# EAGLE design CTI_Osc (EAGLE 6.2)
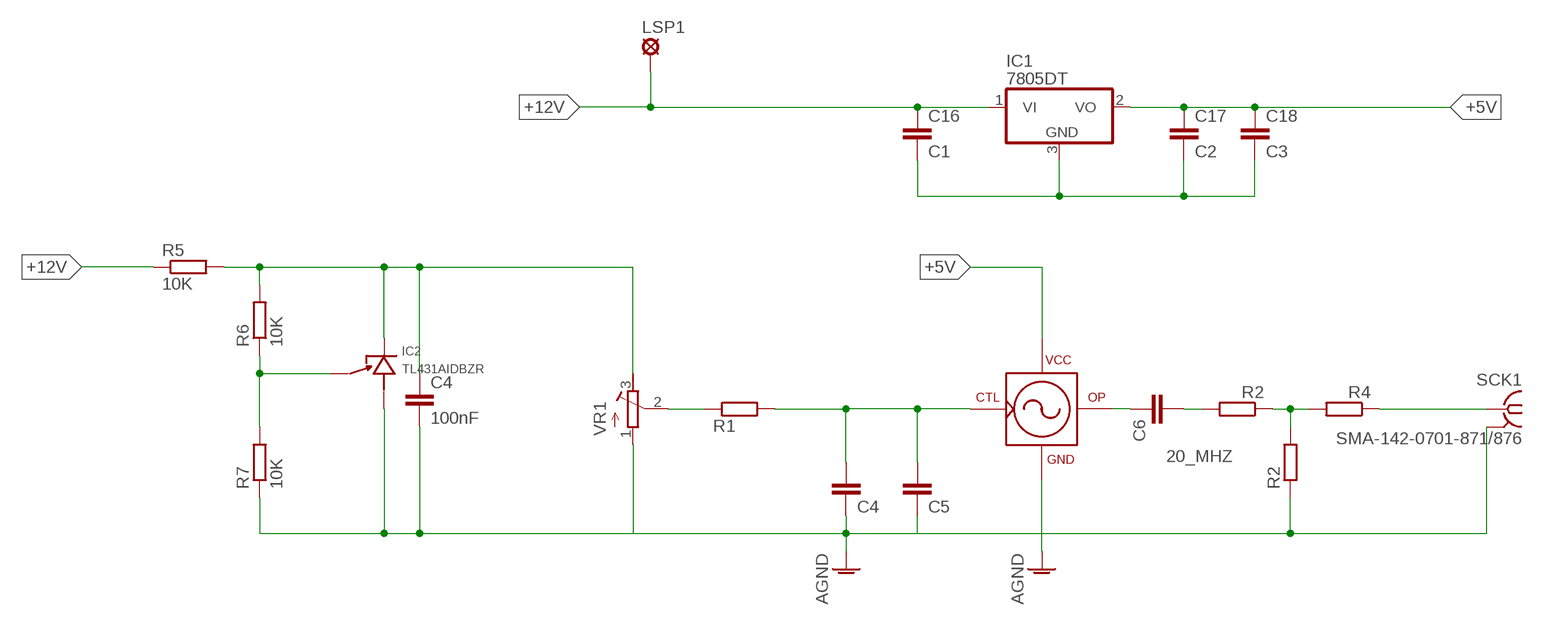
[diagram p0: schematic, sheet 1, part 1 of 2]
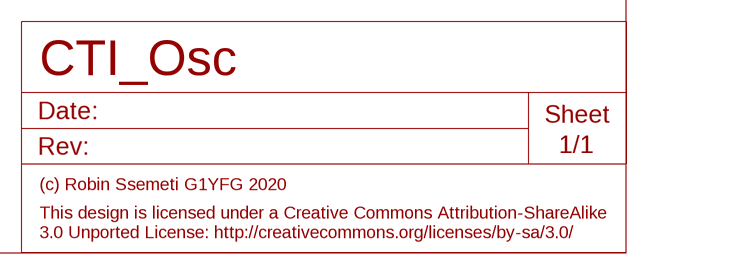
[diagram p1: schematic, sheet 1, part 2 of 2]

## Parts
C4  100nF  C-EUC0603  [C0603]
C16  C1  C-EUC0805  [C0805]
C17  C2  C-EUC0805  [C0805]
C18  C3  C-EUC0805  [C0805]
C24  C4  C-EUC0603  [C0603]
C25  C5  C-EUC0603  [C0603]
C28  C6  C-EUC0603  [C0603]
IC1  7805DT  [TO252]
IC2  TL431AIDBZR  [SOT23L]
LSP1  LSP13  [LSP13]
OSC1  CTI_OSC  [CTI_OSC]
R1  R2  R-EU_R0603  [R0603]
R2  R3  R-EU_R0603  [R0603]
R3  R4  R-EU_R0603  [R0603]
R5  10K  R-EU_R0603  [R0603]
R6  10K  R-EU_R0603  [R0603]
R7  10K  R-EU_R0603  [R0603]
R13  R1  R-EU_R0603  [R0603]
SCK1  SMA-142-0701-871/876  [J502-ND-142-0701-871/876]
VR2  VR1  R-TRIMM64Y  [RTRIM64Y]

## Nets
20_MHZ: C28.2 OSC1.OUT(OP)
+5V: C17.1 C18.1 IC1.2(VO) OSC1.VCC
+5V_PRECISION: C4.1 IC2.G(CATHODE) R5.2 R6.2 VR2.3(A)
+12V [PWR]: C16.1 IC1.1(VI) LSP1.MP R5.1
GND [PWR]: C4.2 C16.2 C17.2 C18.2 C24.2 C25.2 IC1.3(GND) IC2.D(ANODE) OSC1.GND R2.1 R7.1 SCK1.G@1(GND) VR2.1(E) ; supply symbol labelled AGND
N$1: C28.1 R1.2
N$2: R1.1 R2.2 R3.2
N$3: R3.1 SCK1.1
N$19: R13.1 VR2.2(S)
N$32: C24.1 C25.1 OSC1.REF(CTRL) R13.2
N$42: IC2.S(CTRL) R6.1 R7.2

## Power pins joined to a net without a drawn wire
GND: SCK1.G@2(GND) SCK1.G@3(GND) SCK1.G@4(GND)

## Library data of the parts
C4 C16-C18 C24 C25 = rcl:C-EU: CAPACITOR, European symbol
C28 = resistor:C-EU: CAPACITOR, European symbol
IC1 = linear:78*: Positive VOLTAGE REGULATOR Source: http://cache.national.com/ds/LM/LM78L05.pdf http://www.fairchildsemi.com/ds/LM/LM7805.pdf
IC2 = RF:TL431AIDBZR
LSP1 = solpad:LSP13: SOLDER PAD drill 1.3 mm, distributor Buerklin, 12H562
OSC1 = RF:CTI_OSC
R1-R3 R5-R7 R13 = rcl:R-EU_: RESISTOR, European symbol
SCK1 = con-coax:SMA-: SMA 50 Ohm End Launch Jack Receptacle - Round Contact Johnson Components Source: www.johnsoncomponents.com .. J502-ND.pdf; MF: JOHNSON COMPONENTS; MPN: 142-0701-871; OC_FARNELL: 1339835; OC_NEWARK: 91B6105
VR2 = resistor:R-TRIMM: Trimm resistor

## Net classes
1 50ohm: width 0.508 mm, clearance 0.762 mm
2 PWR: clearance 0.8 mm
3 TG: clearance 0.5 mm

## Board
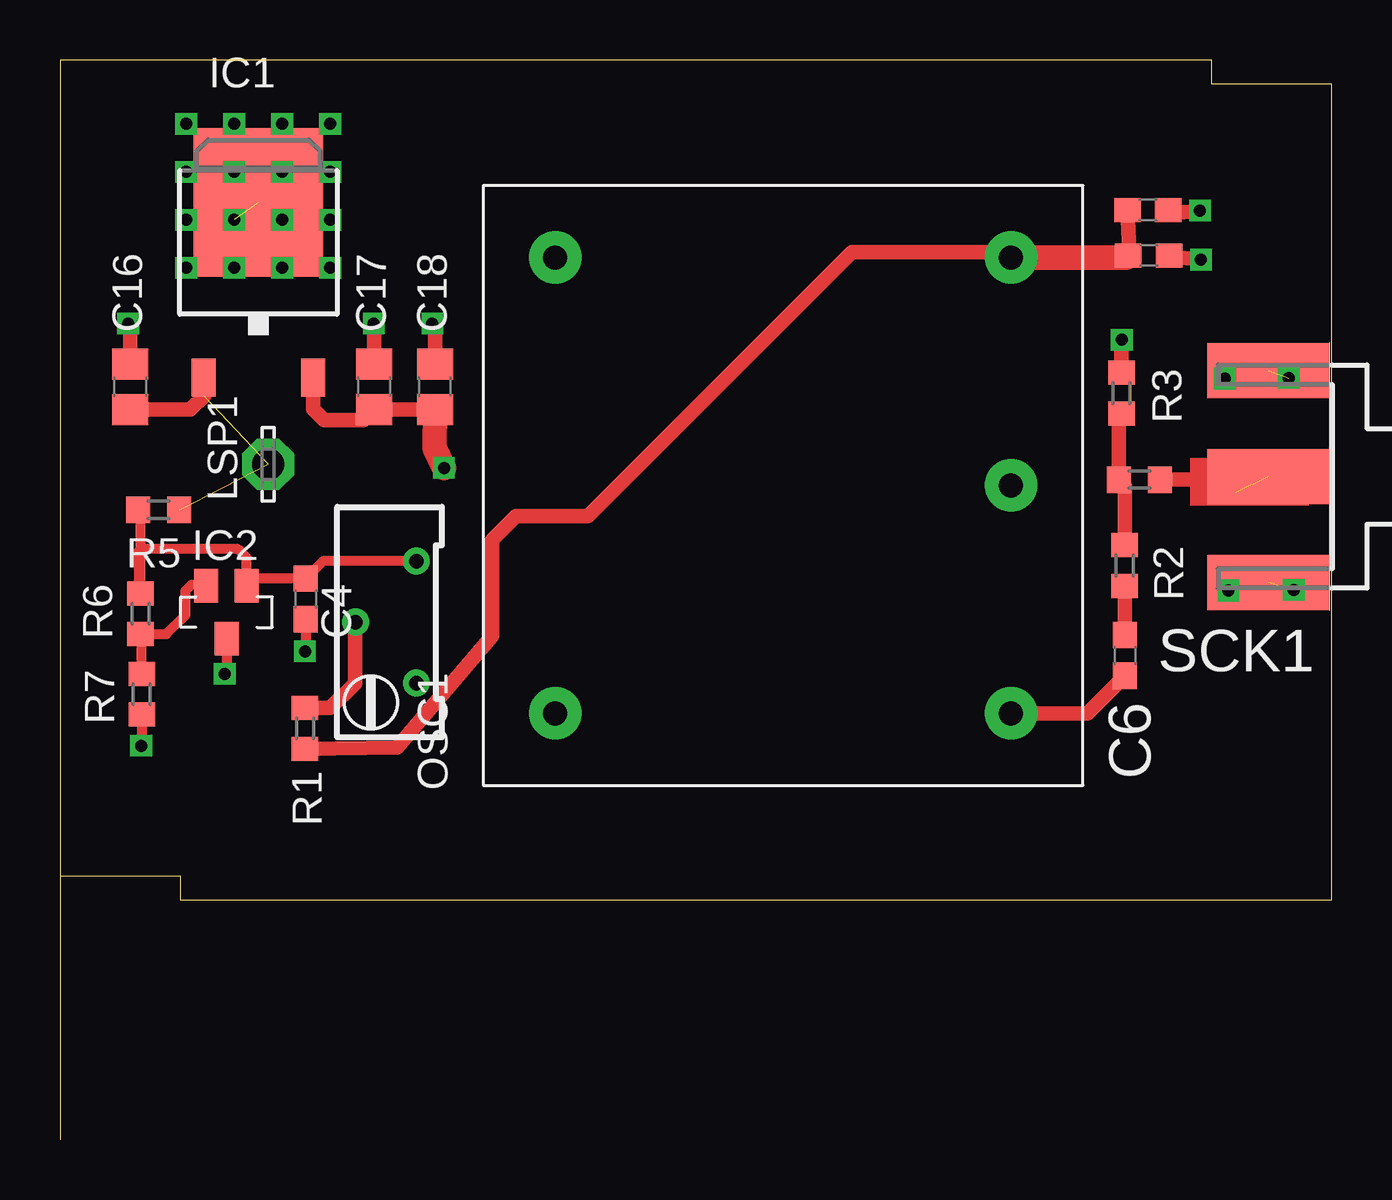
[diagram p2: board, top side]
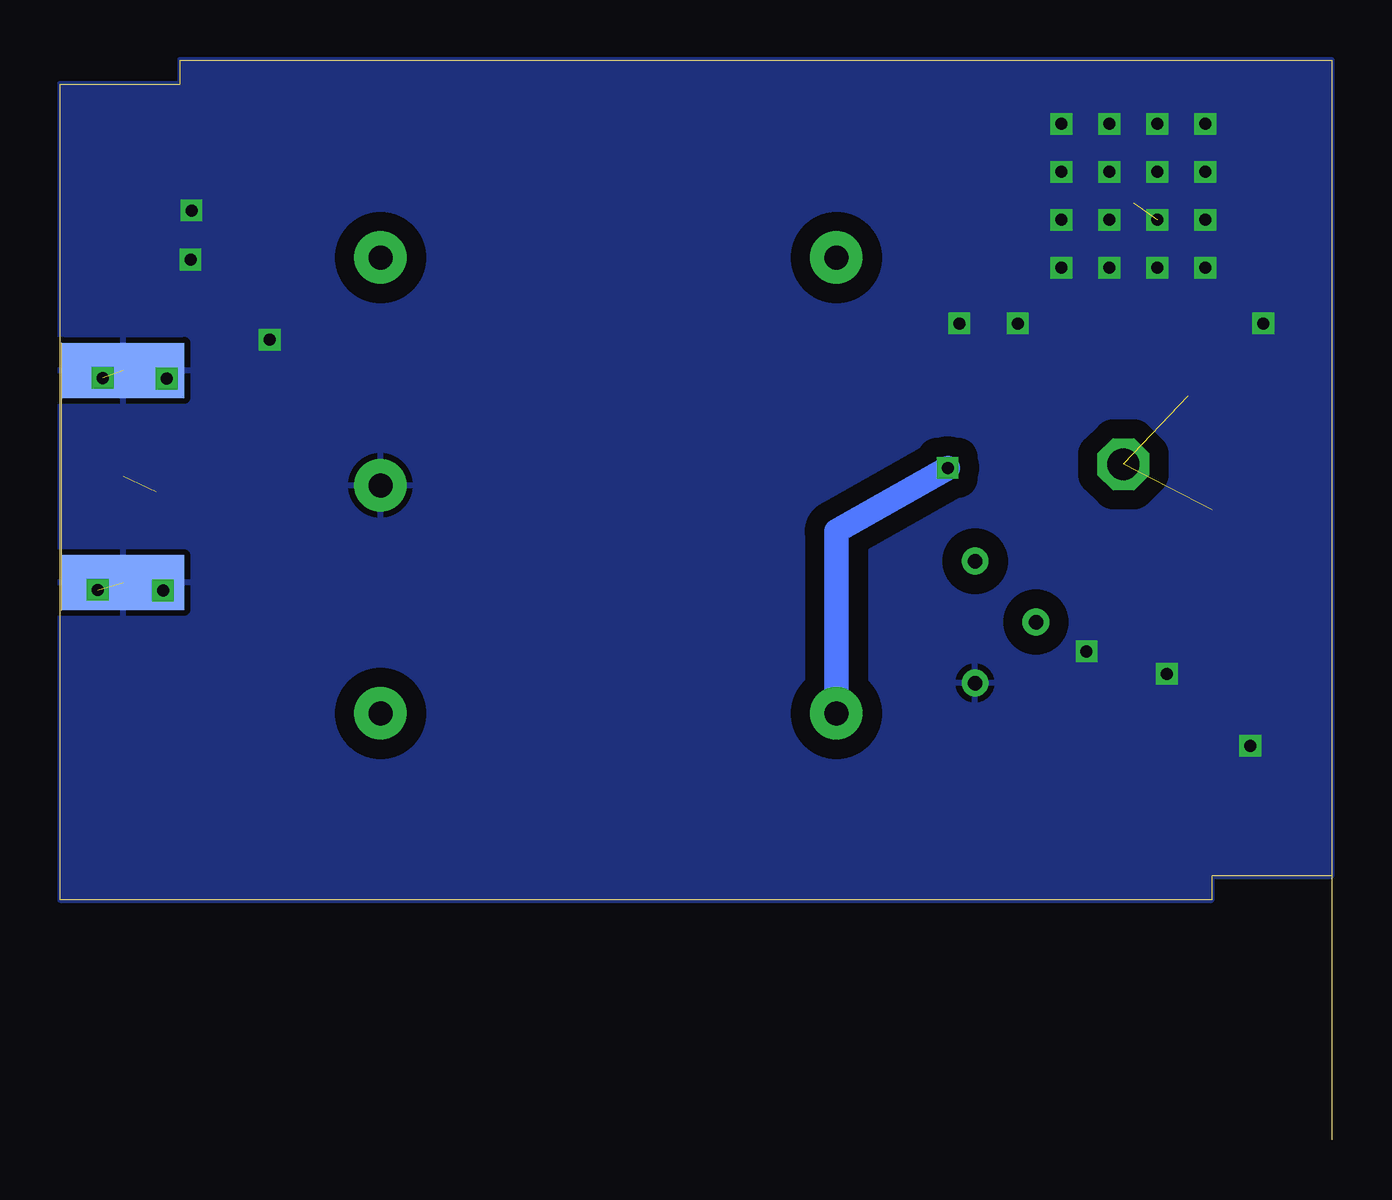
[diagram p3: board, bottom side, seen from below]

Size 53 x 45 mm. Coordinates in mm from the lower left corner, seen from the top.
Outline: 0,11 5,11 5,10 53,10 53,44 48,44 48,45 0,45 0,11
Outline: 0,11 0,0
Copper layers ((1*2)+(15*16)): Top 0.035mm / dielectric 1.5mm / Route2 0.035mm / dielectric 0.15mm / Route15 0.035mm / dielectric 0.2mm / Power 0.035mm
Design rules: minimum track width 10mil, minimum drill 0.3mm, track to track 5mil, track to pad 5mil, pad to pad 3mil, via to via 5mil, smd to smd 2mil, copper to edge 0mil, drill to drill 8mil, minimum pad ring 10mil, minimum via ring 8mil, stop-mask expansion 4mil, vias tented up to drill 0mil, thermal gap 10mil

### Footprints (pad centres in the part's own frame; a part is rotated, then mirrored left to right if it is on the bottom)
C0603 = smd 1.1 x 1: 1 -0.85,0; 2 0.85,0
C0805 = smd 1.3 x 1.5: 1 -0.95,0; 2 0.95,0
TO252 = smd 1 x 1.6: 1 -2.28,-4.8; 2 2.28,-4.8 | smd 5.4 x 6.2: 3 0,2.5
SOT23L = smd 1 x 1.4: D 0,1.1; G -0.85,-1.1; S 0.85,-1.1
LSP13 = drill 1.321 pad 2.159 octagon: MP 0,0
CTI_OSC = drill 1 pad 2.184: GND 0,-9.5; NC 9.5,9.5; OUT -9.5,-9.5; REF 9.5,-9.5; VCC -9.5,9.5
R0603 = smd 1 x 1.1: 1 -0.85,0; 2 0.85,0
J502-ND-142-0701-871/876 = smd 5.08 x 2.286: 1 2.565,0; G@1 2.565,4.42; G@2 2.565,-4.42 | smd 5.08 x 2.286 bottom: G@3 2.565,4.42; G@4 2.565,-4.42
RTRIM64Y = drill 0.61: 1 0,-2.54; 2 -2.54,0; 3 0,2.54

### Placement (x,y rotation side)
C4  10.25,22.54 270 top
C16  2.93,31.38 90 top
C17  13.09,31.38 90 top
C18  15.63,31.38 90 top
C24  45.38,36.85 0 top
C25  45.34,38.74 0 top
C28  44.39,20.18 270 top
IC1  8.27,36.56 0 top
IC2  6.94,21.98 180 top
LSP1  8.67,28.15 90 top
OSC1  30.14,27.27 90 top
R1  44.38,23.93 270 top
R2  44.24,31.11 270 top
R3  44.99,27.5 180 top
R5  4.12,26.25 180 top
R6  3.36,21.91 90 top
R7  3.41,18.56 90 top
R13  10.21,17.14 270 top
SCK1  52.92,27.64 180 top
VR2  14.86,21.57 0 top

### Tracks (layer width: path | path; a pad name or v marks a point on that pad's centre or on a via)
20_MHZ
  Top 0.61: OSC1.OUT 42.82,17.77 C28.2
+5V  (via drill 0.5)
  Top 0.61: C18.1 C17.1 12.66,30 11,30 10.55,30.45 IC1.2
  Top 1.016: v16,28 15.62,28.83 C18.1
  Power 1.016: v16,28 20.64,25.36 OSC1.VCC
+5V_PRECISION
  Top 0.406: VR2.3 10.97,24.11 C4.1 8.09,23.39 IC2.G 7.79,24.23 7.42,24.61 3.35,24.61 3.28,24.53 3.28,22.84 R6.2 3.36,26.16 R5.2
+12V  (2 unrouted)
  Top 0.61: C16.1 5.42,30.43 6,31 IC1.1
GND  (via drill 0.5)  (5 unrouted)
  Top 0.406: R7.1 3.41,16.45 v3.38,16.42 | IC2.D 6.94,19.49 v6.86,19.41 | C4.2 10.25,20.39 v10.21,20.35
  Top 0.61: R2.1 44.24,33.32 v44.26,33.34 | C24.2 46.5,36.79 v47.56,36.67 | C25.2 46.84,38.65 v47.52,38.73 | C16.2 2.93,33.94 v2.85,34.02 | C17.2 v13.09,34.01 v13.08,34.02 | C18.2 15.63,33.91 v15.52,34.02
  other vias: 48.55,31.72 51.22,31.75 48.7,22.89 51.42,22.91 5.26,42.34 7.26,42.34 9.26,42.34 11.26,42.34 5.26,40.34 7.26,40.34 9.26,40.34 11.26,40.34 11.26,38.34 9.26,38.34 7.26,38.34 5.26,38.34 5.26,36.34 7.26,36.34 9.26,36.34 11.26,36.34
  pour Power: 0,45 48,45 48,44 53,44 53,10 5,10 5,11 0,11
N$1
  Top 0.61: C28.1 44.39,23.06 R1.2
N$2
  Top 0.61: R1.1 44.38,27.27 R3.2 44.14,30.16 R2.2
N$3  (1 unrouted)
  Top 0.61: R3.1 48.5,27.5 49,27
N$19
  Top 0.61: R13.1 11.27,17.99 12.29,19.02 12.29,21.55 VR2.2
N$32
  Top 0.61: C24.1 44.55,37.52 C25.1 44.56,38.67 | OSC1.REF 39.41,37 33,37 22,26 19,26 18,25 18,21 14.05,16.34 R13.2
  Top 1.016: OSC1.REF 44.45,36.77 C24.1
N$42
  Top 0.406: R7.2 3.41,21.01 R6.1 4.43,21.06 5.23,21.86 5.23,22.88 5.49,23.13 6.04,23.13 IC2.S
(copper drawn outside any net)
  shapes: Top area x1

### Text on the board
tNames: C6
bDocu: G1YFG